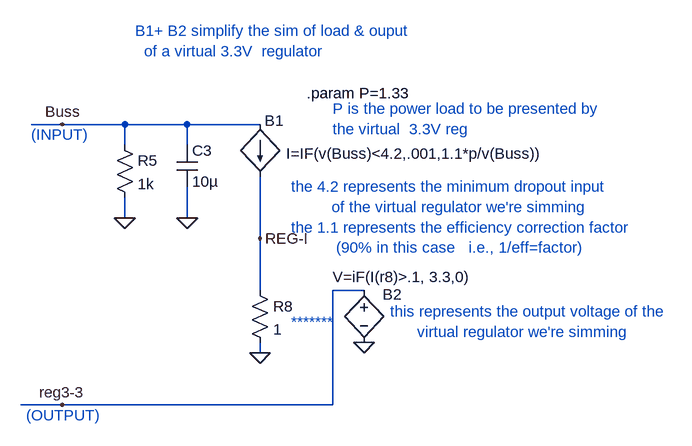
[diagram p0: schematic const-pwr-load-3.asc]
const-pwr-load-3.asc, the LTspice schematic file:
Version 4
SHEET 1 2492 1416
WIRE 768 208 720 208
WIRE 864 208 768 208
WIRE 960 208 864 208
WIRE 1072 208 960 208
WIRE 864 240 864 208
WIRE 960 240 960 208
WIRE 864 352 864 320
WIRE 960 352 960 304
WIRE 1072 384 1072 288
WIRE 1072 464 1072 384
WIRE 1232 464 1184 464
WIRE 1072 560 1072 544
WIRE 768 640 704 640
WIRE 1184 640 1184 464
WIRE 1184 640 768 640
FLAG 960 352 0
FLAG 864 352 0
FLAG 1072 560 0
FLAG 768 208 Buss
FLAG 1072 384 REG-I
FLAG 1232 544 0
FLAG 768 640 reg3-3
SYMBOL bi 1072 208 R0
WINDOW 0 7 -6 Left 0
WINDOW 3 40 45 Left 0
SYMATTR InstName B1
SYMATTR Value I=IF(v(Buss)<4.2,.001,1.1*p/v(Buss))
SYMBOL cap 944 240 R0
SYMATTR InstName C3
SYMATTR Value 10µ
SYMBOL res 848 224 R0
SYMATTR InstName R5
SYMATTR Value 1k
SYMBOL res 1056 448 R0
SYMATTR InstName R8
SYMATTR Value 1
SYMBOL bv 1232 448 R0
WINDOW 3 -48 -5 Left 0
WINDOW 0 29 22 Left 0
SYMATTR Value V=iF(I(r8)>.1, 3.3,0)
SYMATTR InstName B2
TEXT 1184 184 Left 0 ;P is the power load to be presented by\nthe virtual  3.3V reg
TEXT 1120 512 Left 0 ;*******
TEXT 880 64 Left 0 ;B1+ B2 simplify the sim of load & ouput\n  of a virtual 3.3V  regulator
TEXT 1120 304 Left 0 ;the 4.2 represents the minimum dropout input \n         of the virtual regulator we're simming\nthe 1.1 represents the efficiency correction factor\n          (90% in this case   i.e., 1/eff=factor)
TEXT 1272 496 Left 0 ;this represents the output voltage of the \n      virtual regulator we're simming
TEXT 1144 160 Left 0 !.param P=1.33
TEXT 720 224 Left 0 ;(INPUT)
TEXT 712 656 Left 0 ;(OUTPUT)

The netlist it stands for:
* const-pwr-load-3.asc
B1 Buss REG-I I=IF(v(Buss)<4.2,.001,1.1*p/v(Buss))
C3 Buss 0 10µ
R5 Buss 0 1k
R8 REG-I 0 1
B2 reg3-3 0 V=iF(I(r8)>.1, 3.3,0)
* P is the power load to be presented by
* the virtual  3.3V reg
* *******
* B1+ B2 simplify the sim of load & ouput
*   of a virtual 3.3V  regulator
* the 4.2 represents the minimum dropout input
*          of the virtual regulator we're simming
* the 1.1 represents the efficiency correction factor
*           (90% in this case   i.e., 1/eff=factor)
* this represents the output voltage of the
*       virtual regulator we're simming
.param P=1.33
* (INPUT)
* (OUTPUT)
.backanno
.end